# EAGLE design ArmazConnectLite - Rev A1 (EAGLE 7.7.0)
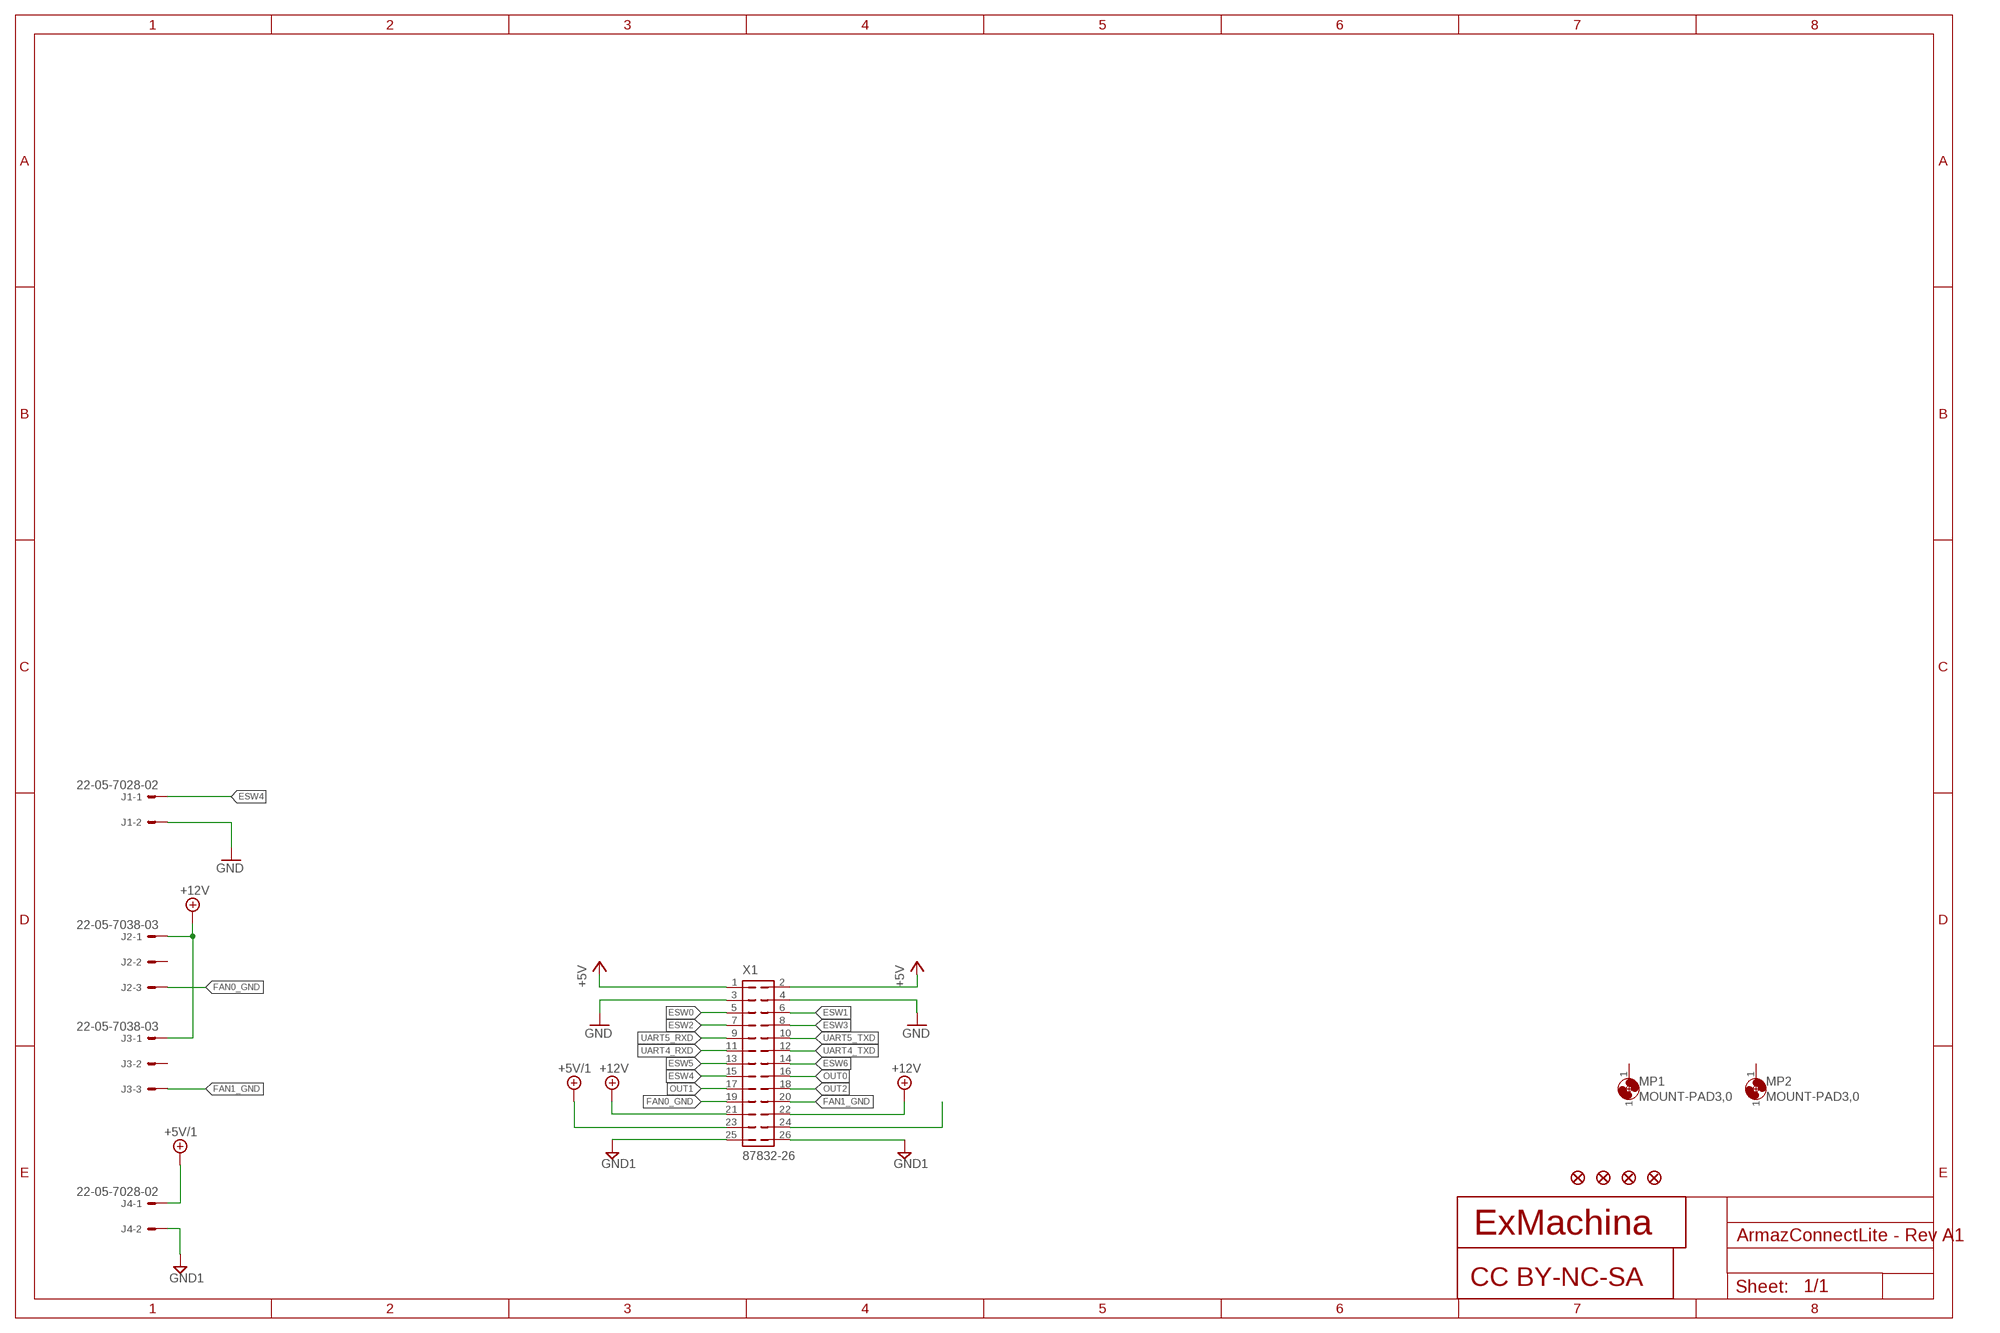
[diagram p0: schematic, sheet 1]

## Parts
CC1  CC-BY-NC-SA  [CC-BY-NC-SA]
J1  22-05-7028-02  [7395-02]
J2  22-05-7038-03  [7395-03]
J3  22-05-7038-03  [7395-03]
J4  22-05-7028-02  [7395-02]
JP1  FIDUCIAL1X2  [FIDUCIAL-1X2]
JP2  FIDUCIAL1X2  [FIDUCIAL-1X2]
JP3  FIDUCIAL1X2  [FIDUCIAL-1X2]
JP4  FIDUCIAL1X2  [FIDUCIAL-1X2]
MP1  MOUNT-PAD3,0  [P3,0]
MP2  MOUNT-PAD3,0  [P3,0]
T1  EXMACHINA-LOGO-NAME  [EXM-LOGO-BASELINE]
X1  87832-26  [87832-26]

## Nets
+5V [supply]: X1.1 X1.2
+5V/1 [supply]: J4.1 X1.23
+12V [supply]: J2.1 J3.1 X1.21 X1.22
ESW0: X1.5
ESW1: X1.6
ESW2: X1.7
ESW3: X1.8
ESW4: J1.1 X1.15
ESW5: X1.13
ESW6: X1.14
FAN0_GND [supply2]: J2.3 X1.19
FAN1_GND [supply2]: J3.3 X1.20
GND [supply]: J1.2 X1.3 X1.4
GND1 [supply]: J4.2 X1.25 X1.26
N$1 [supply2]: X1.24
OUT0: X1.16
OUT1: X1.17
OUT2: X1.18
UART4_RXD: X1.11
UART4_TXD: X1.12
UART5_RXD: X1.9
UART5_TXD: X1.10
Unconnected: J2.2 J3.2 MP1.1 MP2.1

## Library data of the parts
CC1 = cc-by-sa:CC-BY-NC-SA
J1 J4 = con-molex:22-?-02: CONNECTOR wire to board 2.54 mm (.1 inch) pitch header; OC_FARNELL: 9731601; OC_NEWARK: unknown
J2 J3 = con-molex:22-?-03: CONNECTOR wire to board 2.54 mm (.1 inch) pitch header; MF: MOLEX; MPN: 22-05-7038; OC_FARNELL: 9731610; OC_NEWARK: unknown
JP1-JP4 = SparkFun:FIDUCIAL: Fiducial Alignment Points Various fiducial points for machine vision alignment.
MP1 MP2 = holes:MOUNT-PAD: MOUNTING HOLE with drill center marker
T1 = exmachina:EXMACHINA-LOGO; OC_FARNELL: unknown
X1 = con-molex:87832-26: Milli-Grid Header 2.00mm (.079") Pitch; MF: MOLEX; MPN: 87832-2620; OC_FARNELL: 2313712; OC_NEWARK: unknown

## Net classes
0 default: width 0.203 mm, drill 0.25 mm, clearance 0.205 mm
1 supply: width 0.406 mm, drill 0.4 mm, clearance 0.205 mm to class 0, clearance 0.205 mm
2 supply2: width 0.406 mm, drill 0.35 mm, clearance 0.205 mm to class 0, clearance 0.205 mm to class 1, clearance 0.205 mm

## Board
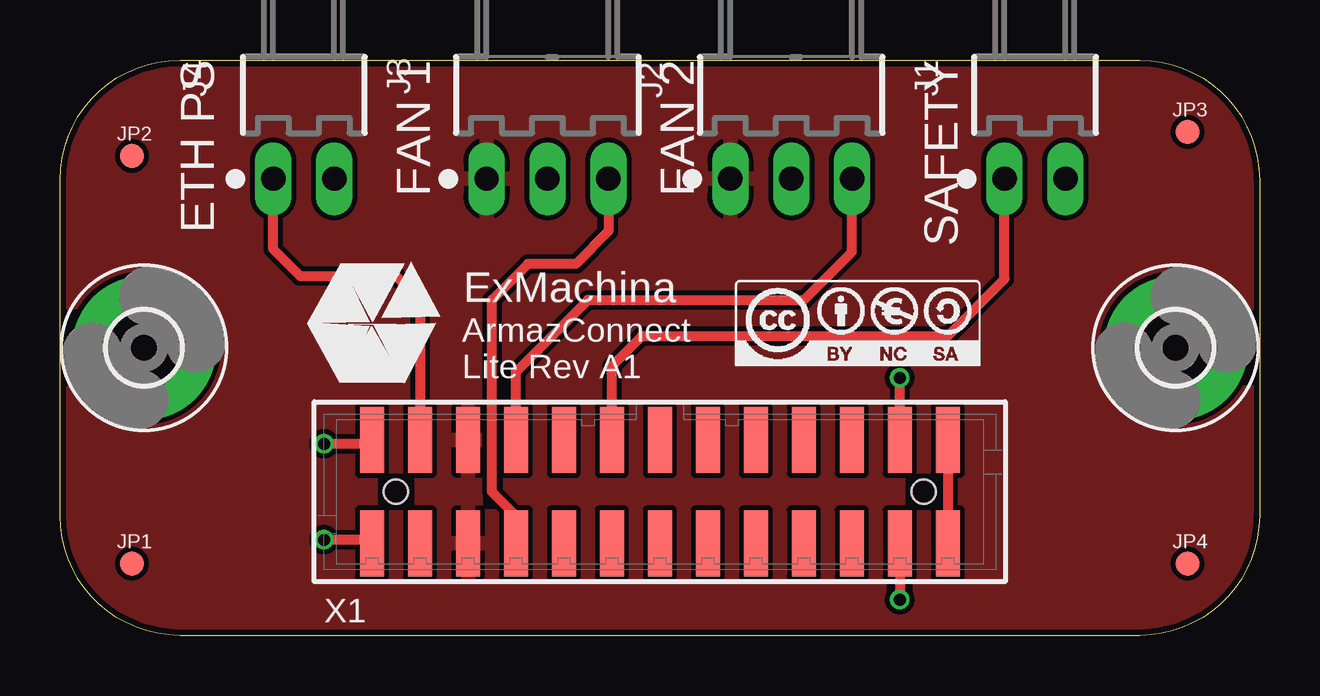
[diagram p1: board, top side]
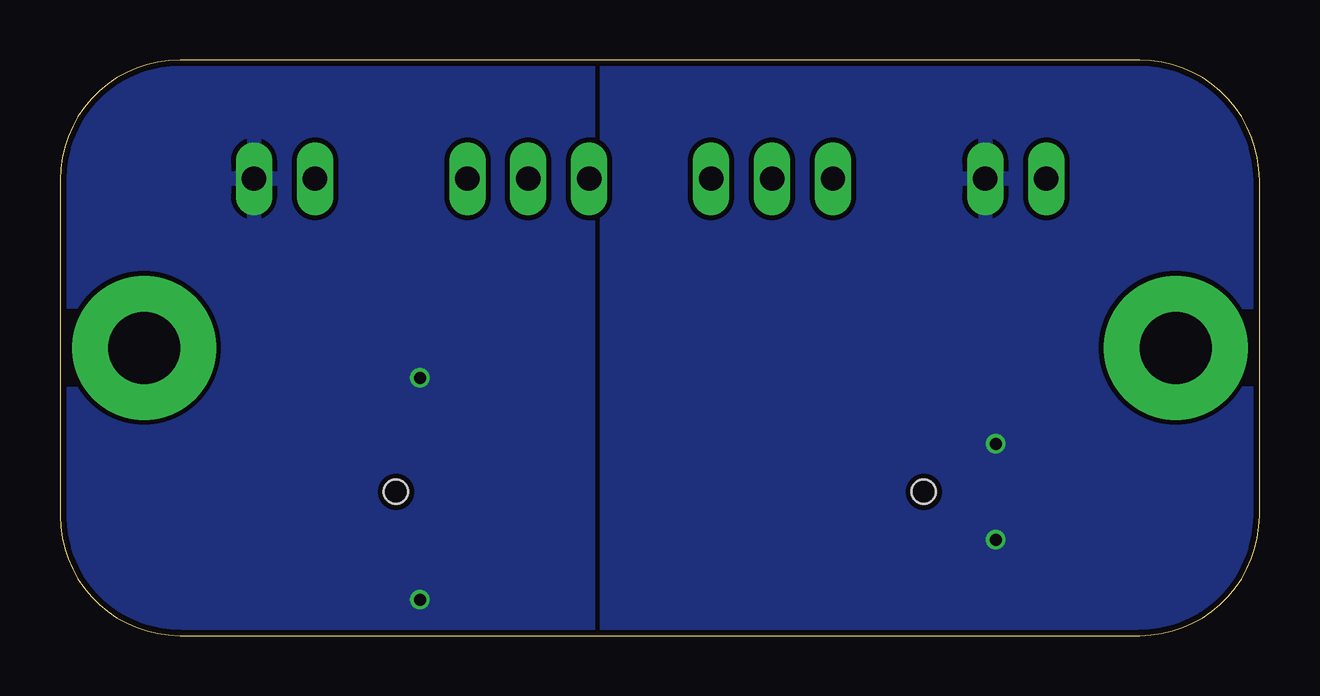
[diagram p2: board, bottom side, seen from below]

Size 50 x 24 mm. Coordinates in mm from the lower left corner, seen from the top.
Outline: 0,5 0,19 arc-90 5,24 45,24 arc-90 50,19 50,5 arc-90 45,0 5,0 arc-90 0,5
Copper layers (1*16): Top 0.018mm / dielectric 1.55mm / Bottom 0.018mm
Design rules "eC_2Layer_PClass5_BaseCopperO18 *": minimum track width 0.175mm, minimum drill 0.35mm, track to track 0.175mm, track to pad 0.175mm, pad to pad 0.175mm, via to via 0.175mm, smd to smd 0mil, copper to edge 0.25mm, drill to drill 0.35mm, minimum pad ring 0.2mm, minimum via ring 0.15mm, stop-mask expansion 0mil, vias tented up to drill 0.45mm, thermal gap 0.2mm

### Footprints (pad centres in the part's own frame; a part is rotated, then mirrored left to right if it is on the bottom)
7395-02 = drill 1.016 long: 1 1.27,0; 2 -1.27,0
7395-03 = drill 1.016 long: 1 2.54,0; 2 0,0; 3 -2.54,0
FIDUCIAL-1X2 = smd 1 x 1: 1 0,0
P3,0 = drill 3 pad 6: 1 0,0
87832-26 = smd 1 x 2.75: 1 -12,-2.15; 2 -12,2.15; 3 -10,-2.15; 4 -10,2.15; 5 -8,-2.15; 6 -8,2.15; 7 -6,-2.15; 8 -6,2.15; 9 -4,-2.15; 10 -4,2.15; 11 -2,-2.15; 12 -2,2.15; 13 0,-2.15; 14 0,2.15; 15 2,-2.15; 16 2,2.15; 17 4,-2.15; 18 4,2.15; 19 6,-2.15; 20 6,2.15; 21 8,-2.15; 22 8,2.15; 23 10,-2.15; 24 10,2.15; 25 12,-2.15; 26 12,2.15 | hole 1: -11,0; 11,0

### Placement (x,y rotation side)
CC1  33.25,13 0 top
J1  40.64,19.05 180 top
J2  30.48,19.05 180 top
J3  20.32,19.05 180 top
J4  10.16,19.05 180 top
JP1  3,3 0 top
JP2  3,20 0 top
JP3  47,21 0 top
JP4  47,3 0 top
MP1  3.5,12 0 top
MP2  46.5,12 0 top
T1  13,13 0 top
U$2  [A4L-LOC]  -98,-86 0 top  (outside the outline)
X1  25,6 180 top

### Tracks (layer width: path | path; a pad name or v marks a point on that pad's centre or on a via)
+5V
  Top 0.406: X1.1 X1.2
+5V/1
  Top 0.406: X1.23 15,14 14,15 10,15 8.89,16.11 J4.1
+12V
  pour Top (rank 6): -6,-3 52,-3 52,25.5 -6,25.5
ESW4
  Top 0.406: X1.15 23,11.25 24.25,12.5 37,12.5 39.37,14.87 J1.1
FAN0_GND
  Top 0.406: X1.19 19,11 22,14 31,14 33,16 33,19.03 J2.3
FAN1_GND
  Top 0.406: X1.20 19,5 18,6 18,14 19.5,15.5 21.5,15.5 22.86,16.86 J3.3
GND  (via drill 0.5)
  Top 0.406: X1.3 v35,10.75 | X1.4 v35,1.5
  pour Bottom (rank 5): 28,-4 53,-4 53,26.5 28,26.5
GND1  (via drill 0.5)
  Top 0.406: X1.25 12.85,8 v11,8 | X1.26 12.85,4 v11,4
  pour Bottom (rank 6): -3,-4 28,-4 28,26.5 -3,26.5

### Text on the board
tPlace: ETH PS | FAN 1 | FAN 2 | SAFETY | ArmazConnect / Lite Rev A1